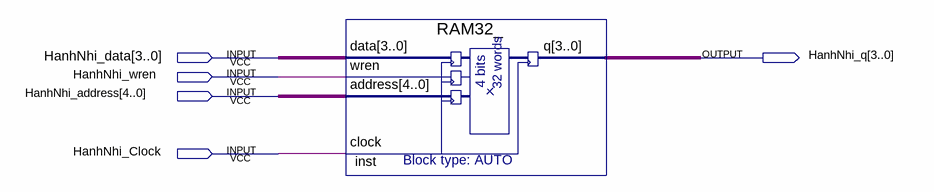
[diagram p0: schematic sheet]
// Quartus schematic Assignment2.bdf as structural Verilog: 1 symbols, 5 pins
module Assignment2 (
  input  [3:0] HanhNhi_data,
  input  HanhNhi_wren,
  input  [4:0] HanhNhi_address,
  input  HanhNhi_Clock,
  output [3:0] HanhNhi_q
);

  RAM32_ inst (
    .data(HanhNhi_data), .wren(HanhNhi_wren), .address(HanhNhi_address), .clock(HanhNhi_Clock), .q(HanhNhi_q));
endmodule
